# Altium schematic sheet Power.SchDoc
size A3; SheetNumber: 2; SheetTotal: 9
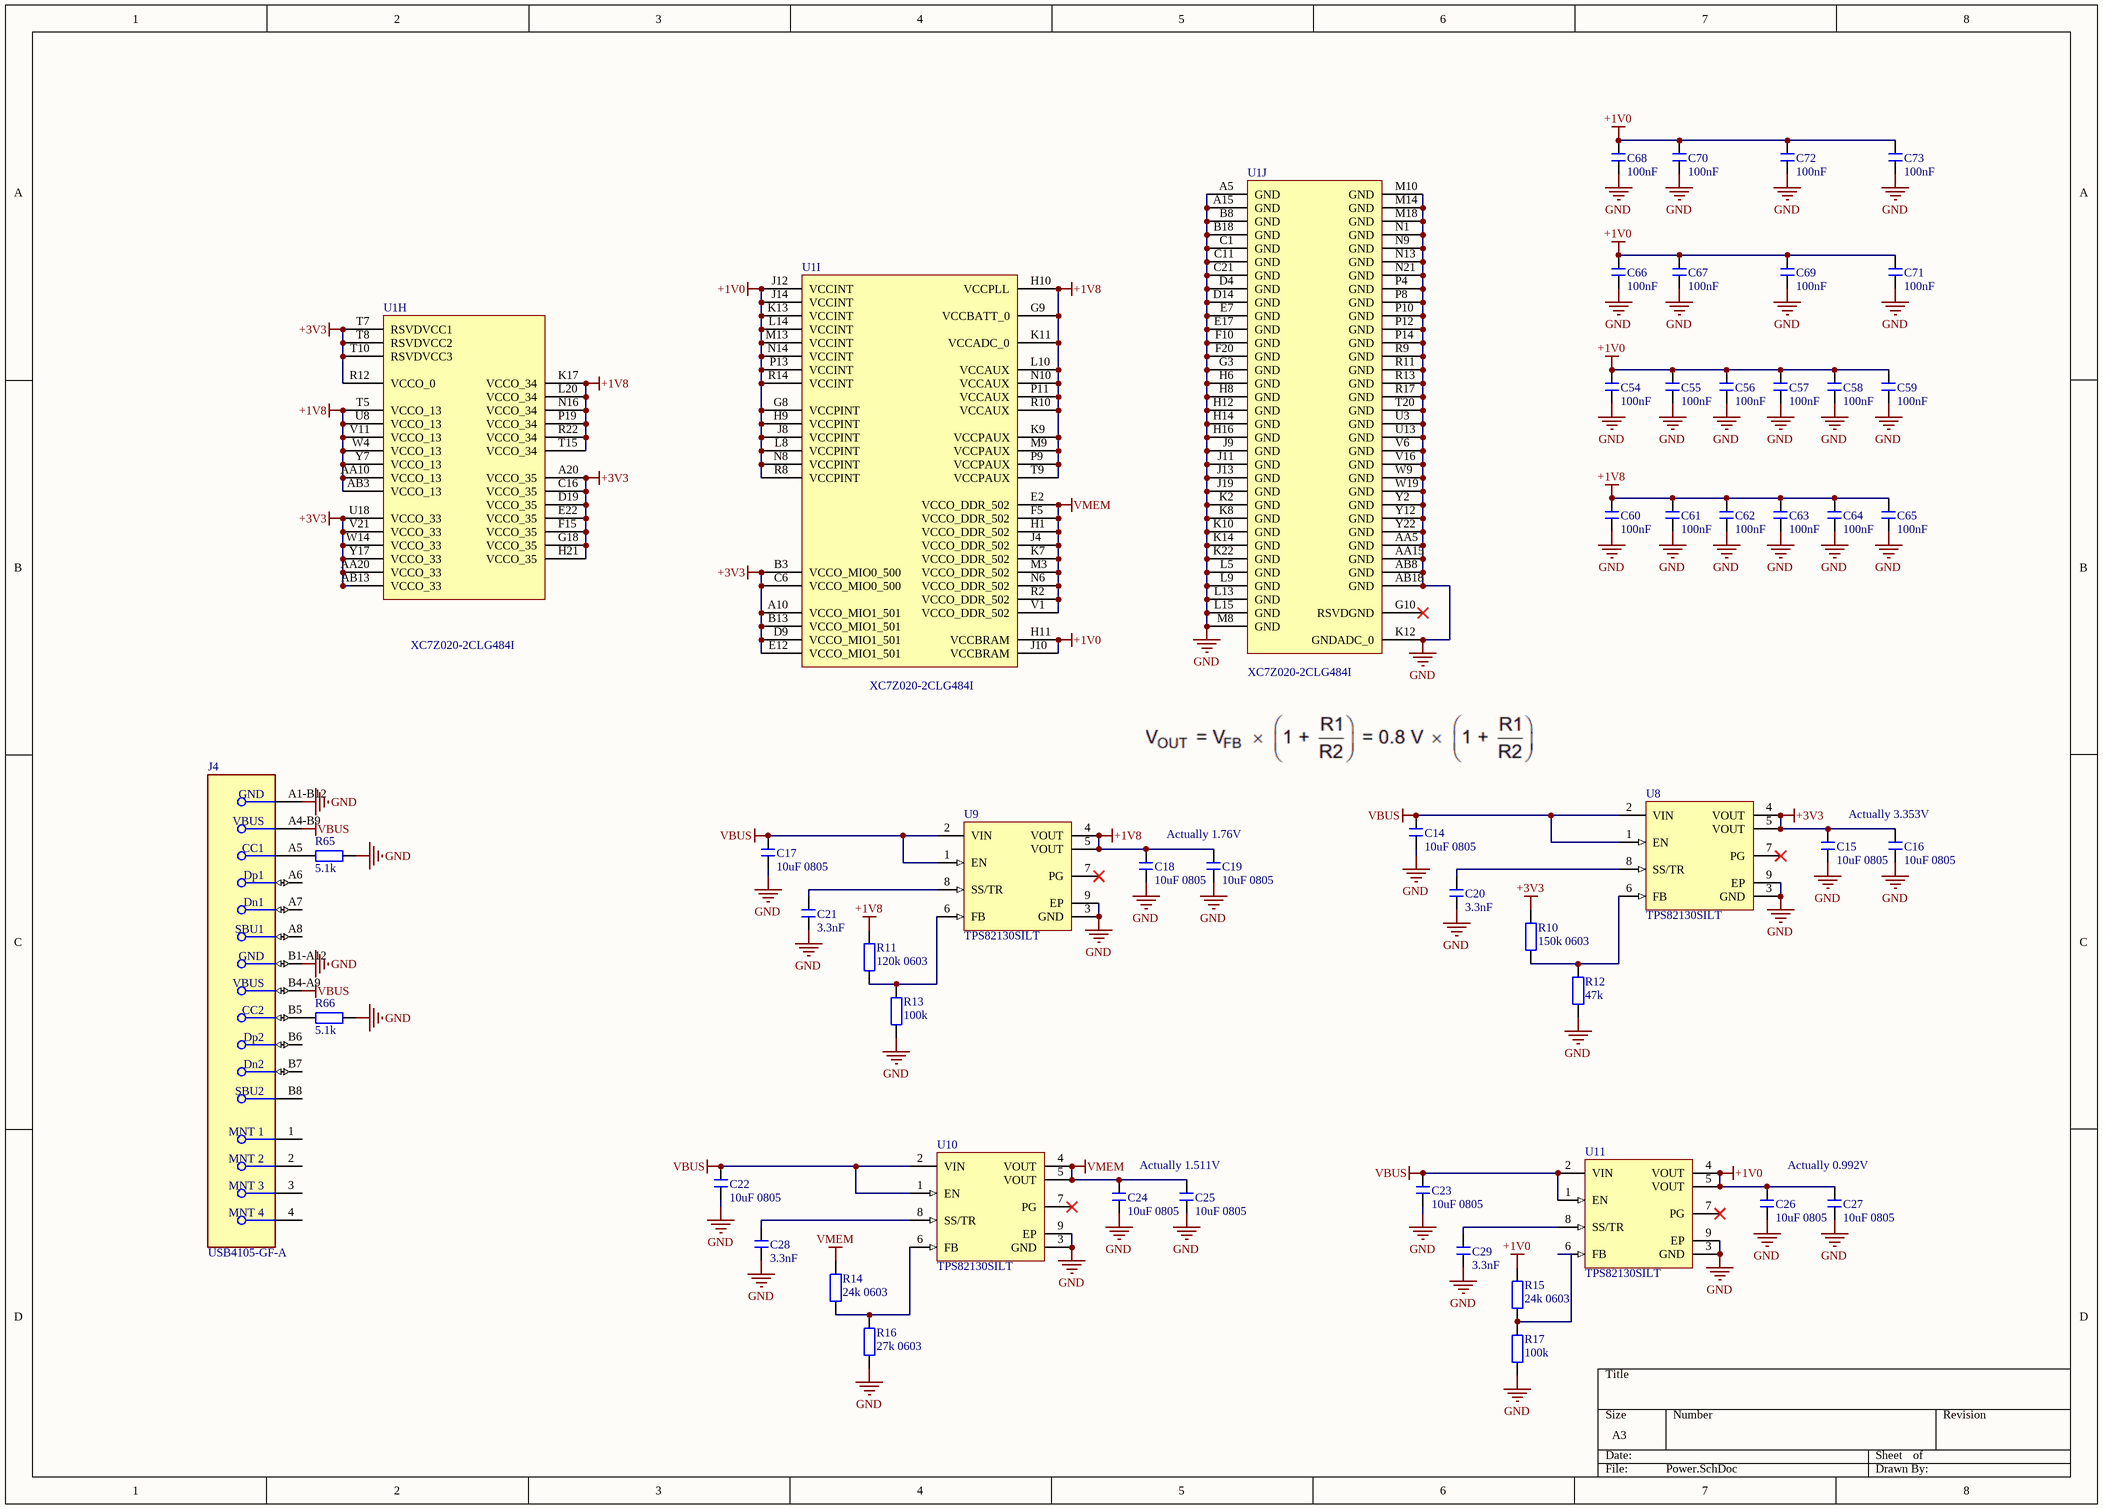
[diagram p0: Power.SchDoc]

## Parts
C14  10uF 0805  [C0603]
C15  10uF 0805  [C0603]
C16  10uF 0805  [C0603]
C17  10uF 0805  [C0603]
C18  10uF 0805  [C0603]
C19  10uF 0805  [C0603]
C20  3.3nF  [C0402]
C21  3.3nF  [C0402]
C22  10uF 0805  [C0603]
C23  10uF 0805  [C0603]
C24  10uF 0805  [C0603]
C25  10uF 0805  [C0603]
C26  10uF 0805  [C0603]
C27  10uF 0805  [C0603]
C28  3.3nF  [C0402]
C29  3.3nF  [C0402]
C54  100nF  [C0402]
C55  100nF  [C0402]
C56  100nF  [C0402]
C57  100nF  [C0402]
C58  100nF  [C0402]
C59  100nF  [C0402]
C60  100nF  [C0402]
C61  100nF  [C0402]
C62  100nF  [C0402]
C63  100nF  [C0402]
C64  100nF  [C0402]
C65  100nF  [C0402]
C66  100nF  [C0402]
C67  100nF  [C0402]
C68  100nF  [C0402]
C69  100nF  [C0402]
C70  100nF  [C0402]
C71  100nF  [C0402]
C72  100nF  [C0402]
C73  100nF  [C0402]
J4  USB4105-GF-A  [FP-USB4105-GF-A-MFG]
R10  150k 0603  [R0603]
R11  120k 0603  [R0603]
R12  47k  [R0402]
R13  100k  [R0402]
R14  24k 0603  [R0603]
R15  24k 0603  [R0603]
R16  27k 0603  [R0603]
R17  100k  [R0402]
R65  5.1k  [R0402]
R66  5.1k  [R0402]
U1  XC7Z020-2CLG484I  [CLG484]  (parts H,I,J of 10)
U8  TPS82130SILT  [SIL0008D_V]
U9  TPS82130SILT  [SIL0008D_V]
U10  TPS82130SILT  [SIL0008D_V]
U11  TPS82130SILT  [SIL0008D_V]

## Nets
+1V0: C26.2 C27.2 C54.2 C55.2 C56.2 C57.2 C58.2 C59.2 C66.2 C67.2 C68.2 C69.2 C70.2 C71.2 C72.2 C73.2 R15.1 U1.G8(VCCPINT) U1.H9(VCCPINT) U1.H11(VCCBRAM) U1.J8(VCCPINT) U1.J10(VCCBRAM) U1.J12(VCCINT) U1.J14(VCCINT) U1.K13(VCCINT) U1.L8(VCCPINT) U1.L14(VCCINT) U1.M13(VCCINT) U1.N8(VCCPINT) U1.N14(VCCINT) U1.P13(VCCINT) U1.R8(VCCPINT) U1.R14(VCCINT) U11.4(VOUT) U11.5(VOUT)
+1V8: C18.2 C19.2 C60.2 C61.2 C62.2 C63.2 C64.2 C65.2 R11.1 U1.AA10(VCCO_13) U1.AB3(VCCO_13) U1.G9(VCCBATT_0) U1.H10(VCCPLL) U1.K9(VCCPAUX) U1.K11(VCCADC_0) U1.K17(VCCO_34) U1.L10(VCCAUX) U1.L20(VCCO_34) U1.M9(VCCPAUX) U1.N10(VCCAUX) U1.N16(VCCO_34) U1.P9(VCCPAUX) U1.P11(VCCAUX) U1.P19(VCCO_34) U1.R10(VCCAUX) U1.R22(VCCO_34) U1.T5(VCCO_13) U1.T9(VCCPAUX) U1.T15(VCCO_34) U1.U8(VCCO_13) U1.V11(VCCO_13) U1.W4(VCCO_13) U1.Y7(VCCO_13) U9.4(VOUT) U9.5(VOUT)
+3V3: C15.2 C16.2 R10.1 U1.A10(VCCO_MIO1_501) U1.A20(VCCO_35) U1.AA20(VCCO_33) U1.AB13(VCCO_33) U1.B3(VCCO_MIO0_500) U1.B13(VCCO_MIO1_501) U1.C6(VCCO_MIO0_500) U1.C16(VCCO_35) U1.D9(VCCO_MIO1_501) U1.D19(VCCO_35) U1.E12(VCCO_MIO1_501) U1.E22(VCCO_35) U1.F15(VCCO_35) U1.G18(VCCO_35) U1.H21(VCCO_35) U1.R12(VCCO_0) U1.T7(RSVDVCC1) U1.T8(RSVDVCC2) U1.T10(RSVDVCC3) U1.U18(VCCO_33) U1.V21(VCCO_33) U1.W14(VCCO_33) U1.Y17(VCCO_33) U8.4(VOUT) U8.5(VOUT)
GND: C14.1 C15.1 C16.1 C17.1 C18.1 C19.1 C20.1 C21.1 C22.1 C23.1 C24.1 C25.1 C26.1 C27.1 C28.1 C29.1 C54.1 C55.1 C56.1 C57.1 C58.1 C59.1 C60.1 C61.1 C62.1 C63.1 C64.1 C65.1 C66.1 C67.1 C68.1 C69.1 C70.1 C71.1 C72.1 C73.1 J4.A1-B12(GND) J4.B1-A12(GND) R12.2 R13.2 R16.2 R17.2 R65.2 R66.2 U1.A5(GND) U1.A15(GND) U1.AA5(GND) U1.AA15(GND) U1.AB8(GND) U1.AB18(GND) U1.B8(GND) U1.B18(GND) U1.C1(GND) U1.C11(GND) U1.C21(GND) U1.D4(GND) U1.D14(GND) U1.E7(GND) U1.E17(GND) U1.F10(GND) U1.F20(GND) U1.G3(GND) U1.H6(GND) U1.H8(GND) U1.H12(GND) U1.H14(GND) U1.H16(GND) U1.J9(GND) U1.J11(GND) U1.J13(GND) U1.J19(GND) U1.K2(GND) U1.K8(GND) U1.K10(GND) U1.K12(GNDADC_0) U1.K14(GND) U1.K22(GND) U1.L5(GND) U1.L9(GND) U1.L13(GND) U1.L15(GND) U1.M8(GND) U1.M10(GND) U1.M14(GND) U1.M18(GND) U1.N1(GND) U1.N9(GND) U1.N13(GND) U1.N21(GND) U1.P4(GND) U1.P8(GND) U1.P10(GND) U1.P12(GND) U1.P14(GND) U1.R9(GND) U1.R11(GND) U1.R13(GND) U1.R17(GND) U1.T20(GND) U1.U3(GND) U1.U13(GND) U1.V6(GND) U1.V16(GND) U1.W9(GND) U1.W19(GND) U1.Y2(GND) U1.Y12(GND) U1.Y22(GND) U8.3(GND) U8.9(EP) U9.3(GND) U9.9(EP) U10.3(GND) U10.9(EP) U11.3(GND) U11.9(EP)
VBUS: C14.2 C17.2 C22.2 C23.2 J4.A4-B9(VBUS) J4.B4-A9(VBUS) U8.1(EN) U8.2(VIN) U9.1(EN) U9.2(VIN) U10.1(EN) U10.2(VIN) U11.1(EN) U11.2(VIN)
VMEM: C24.2 C25.2 R14.1 U1.E2(VCCO_DDR_502) U1.F5(VCCO_DDR_502) U1.H1(VCCO_DDR_502) U1.J4(VCCO_DDR_502) U1.K7(VCCO_DDR_502) U1.M3(VCCO_DDR_502) U1.N6(VCCO_DDR_502) U1.R2(VCCO_DDR_502) U1.V1(VCCO_DDR_502) U10.4(VOUT) U10.5(VOUT)
NetC20_2: C20.2 U8.8(SS/TR)
NetC21_2: C21.2 U9.8(SS/TR)
NetC28_2: C28.2 U10.8(SS/TR)
NetC29_2: C29.2 U11.8(SS/TR)
NetJ4_A5: J4.A5(CC1) R65.1
NetJ4_B5: J4.B5(CC2) R66.1
NetR10_2: R10.2 R12.1 U8.6(FB)
NetR11_2: R11.2 R13.1 U9.6(FB)
NetR14_2: R14.2 R16.1 U10.6(FB)
NetR15_2: R15.2 R17.1 U11.6(FB)

Not connected (* = marked no-connect by the designer): J4 1(MNT_1) 2(MNT_2) 3(MNT_3) 4(MNT_4) A6(Dp1) A7(Dn1) A8(SBU1) B6(Dp2) B7(Dn2) B8(SBU2); U1 G10(RSVDGND)*; U8 7(PG)*; U9 7(PG)*; U10 7(PG)*; U11 7(PG)*

## Notes on the sheet
- Actually 1.76V
- Actually 3.353V
- Actually 1.511V
- Actually 0.992V

## Library data of the parts
C14-C29 C54-C73 = C
J4 = CMP-245163-000001-1: CONN RCPT USB2.0 TYPEC 5A; Manufacturer: GCT; Voltage Rating: 20V; Is Female: yes; Current Rating: 5/6.25/1.25/0.25A; Number Of Contacts: 16; Conn Orientation: Right Angle; Device Class L1: Connectors; Category: Conn; Lead Free: Yes; RoHS: TRUE; Temperature Range High: +85°C; Digikey Description: CONN RCPT USB2.0 TYPEC 5A; Device Class L3: unset; ComponentLink2Description: Datasheet; Manufacturer Part Number: USB4105-GF-A; Package: 0; Usb Standard: USB 2.0; Device Class L2: USB Connectors; Automotive: No; Temperature Range Low: -40°C; Height: 3.46mm; Temperature: -40°C to +85°C; Contact Material: Gold,Nickel; ComponentLink2URL: https://gct.co/files/drawings/usb4105.pdf; Octopart: https://octopart.com/usb4105-gf-a-gct-106627878
R10-R17 R65 R66 = R
U1 = CMP-0363-00013-3: 733 MHz Zynq™-7000 AP SoC, 130 PS I/O, 200 FPGA I/O, 484-Ball BGA, Speed Grade 2, Industrial Grade, Pb-Free; Speed Grade: -2; Flip Flops: 106400; LUTs: 53200; Extensible Block RAM (# 36Kb Blocks): 560 KB (140); ComponentLink3URL: http://www.xilinx.com/support/documentation/data_sheets/ds187-XC7Z010-XC7Z020-Data-Sheet.pdf; PackageReference: CLG484; Code_JEDEC: MO-275-PPAA-2; ComponentLink2URL: http://www.xilinx.com/support/documentation/user_guides/ug865-Zynq-7000-Pkg-Pinout.pdf; ComponentLink2Description: Package Specification; ComponentLink6URL: http://www.xilinx.com/support/documentation/user_guides/ug483_7Series_PCB.pdf; PackageVersion: Rev 1.1, 09/2012; DatasheetVersion: v1.2; PartNumber: XC7Z020-2CLG484I; ComponentLink3Description: DC and AC Switching Characteristics; PackageDescription: Wire-Bond Chip-Scale BGA, Body 19 x 19 mm, 0.8 mm Pitch; RoHS: Pb-Free; ComponentLink5URL: http://www.xilinx.com/support/documentation/user_guides/ug865-Zynq-7000-Pkg-Pinout.pdf; ComponentLink1URL: http://www.xilinx.com/support/documentation/data_sheets/ds190-Zynq-7000-Overview.pdf; ComponentLink4Description: Package File; Generic Part Number: XC7Z020; Mounting Technology: Surface Mount; ComponentLink1Description: Datasheet; ComponentLink4URL: http://www.xilinx.com/support/packagefiles/z7packages/xc7z020clg484pkg.txt; ComponentLink6Description: PCB and Layout Guide; ComponentLink5Description: Packaging and Pinout
U8-U11 = CMP-2000-07569-1: Step-Down Converter MicroSiP(TM) Module with Integrated Inductor, 3 A, 3 to 17 V, -40 to 125 degC, 8-Pin uSiP (SIL), Tape and Reel; Manufacturer: Texas Instruments; Quiescent Current: 20uA; Output Voltage: 5V; Output Current: 3A; Max Input Voltage: 17V; Switching Frequency: 2MHz; Min Output Voltage: 900mV; Number of Outputs: 1; Min Input Voltage: 3V; Datasheet URL: http://www.ti.com/lit/ds/symlink/tps82130.pdf; Packaging: CutTape; Datasheet Version: Rev. C, 01/2017; Package Reference: SIL0008D; Case/Package: SMD/SMT; Manufacturer URL: http://www.ti.com/; Length: 0.12inch; Lead Free: LeadFree; Mount: SurfaceMount; Number of Pins: 8; Package Description: 8-Pin Single In-line Package, Body 3 x 2.8 mm, Pitch 0.65 mm; Max Output Voltage: 5V; Mounting Technology: SurfaceMount; Height: 0.06inch; Max Operating Temperature: 125degC; Width: 0.11inch; Min Operating Temperature: -40degC; Voltage - Output 1: 5V; RoHSCompliant: True; REACH SVHC: NoSVHC; Max Output Current: 3A